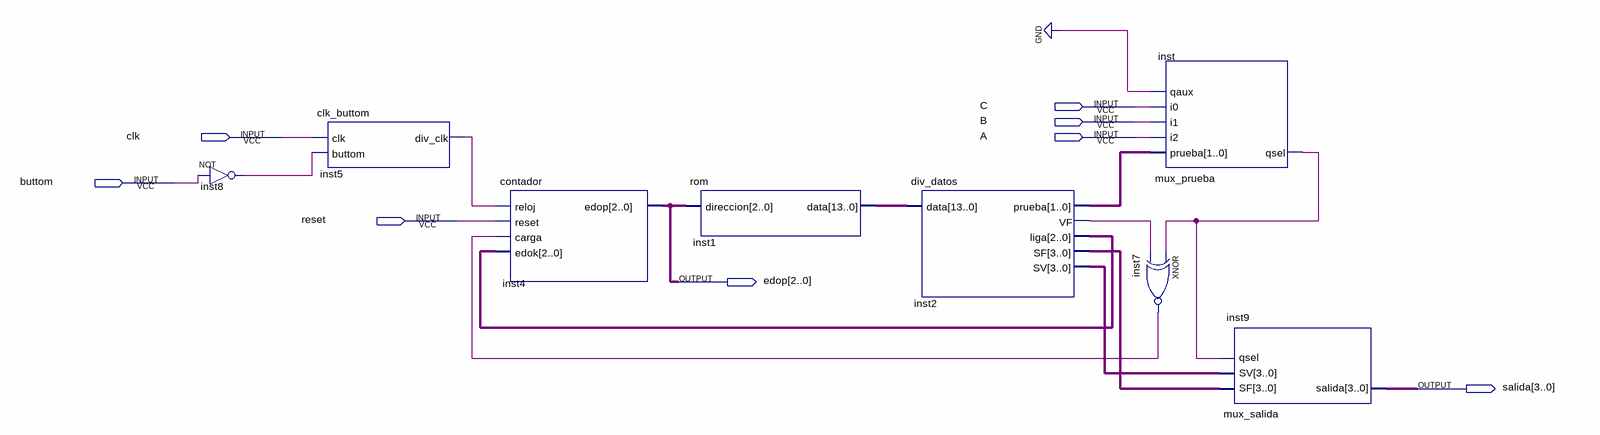
[diagram p0: schematic sheet]
// Quartus schematic practica5.bdf as structural Verilog: 8 symbols, 8 pins
module practica5 (
  input  C,
  input  B,
  input  clk,
  input  A,
  input  buttom,
  input  reset,
  output [2:0] edop,
  output [3:0] salida
);

  wire inst2_vf, inst5_div_clk, inst7_out, inst8_out, inst_qsel;
  wire [1:0] inst2_prueba;
  wire [2:0] inst2_liga;
  wire [3:0] inst2_sf, inst2_sv;
  wire [13:0] inst1_data;

  not inst8 (inst8_out, buttom);
  clk_buttom inst5 (.clk(clk), .buttom(inst8_out), .div_clk(inst5_div_clk));
  contador inst4 (.reloj(inst5_div_clk), .reset(reset), .carga(inst7_out), .edok(inst2_liga), .edop(edop));
  rom inst1 (.direccion(edop), .data(inst1_data));
  div_datos inst2 (
    .data(inst1_data), .prueba(inst2_prueba), .VF(inst2_vf), .liga(inst2_liga), .SF(inst2_sf), .SV(inst2_sv));
  mux_prueba inst (.prueba(inst2_prueba), .i2(A), .i1(B), .i0(C), .qaux(1'b0), .qsel(inst_qsel));
  xnor inst7 (inst7_out, inst_qsel, inst2_vf);
  mux_salida inst9 (.SF(inst2_sf), .SV(inst2_sv), .qsel(inst_qsel), .salida(salida));
endmodule
